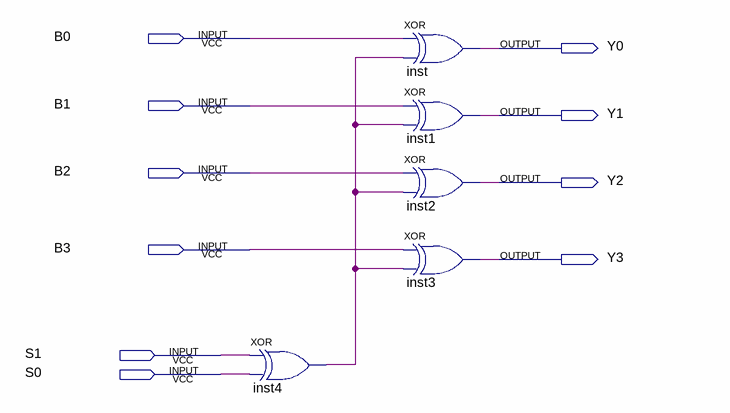
[diagram p0: schematic sheet]
// Quartus schematic BLOX.bdf as structural Verilog: 5 symbols, 10 pins
module BLOX (
  input  B0,
  input  B1,
  input  B2,
  input  B3,
  input  S1,
  input  S0,
  output Y0,
  output Y1,
  output Y2,
  output Y3
);

  wire inst4_out;

  xor inst4 (inst4_out, S1, S0);
  xor inst (Y0, B0, inst4_out);
  xor inst1 (Y1, B1, inst4_out);
  xor inst2 (Y2, B2, inst4_out);
  xor inst3 (Y3, B3, inst4_out);
endmodule
